# Altium schematic sheet Sensors.SchDoc
size A4; SheetNumber: 4; SheetTotal: 4
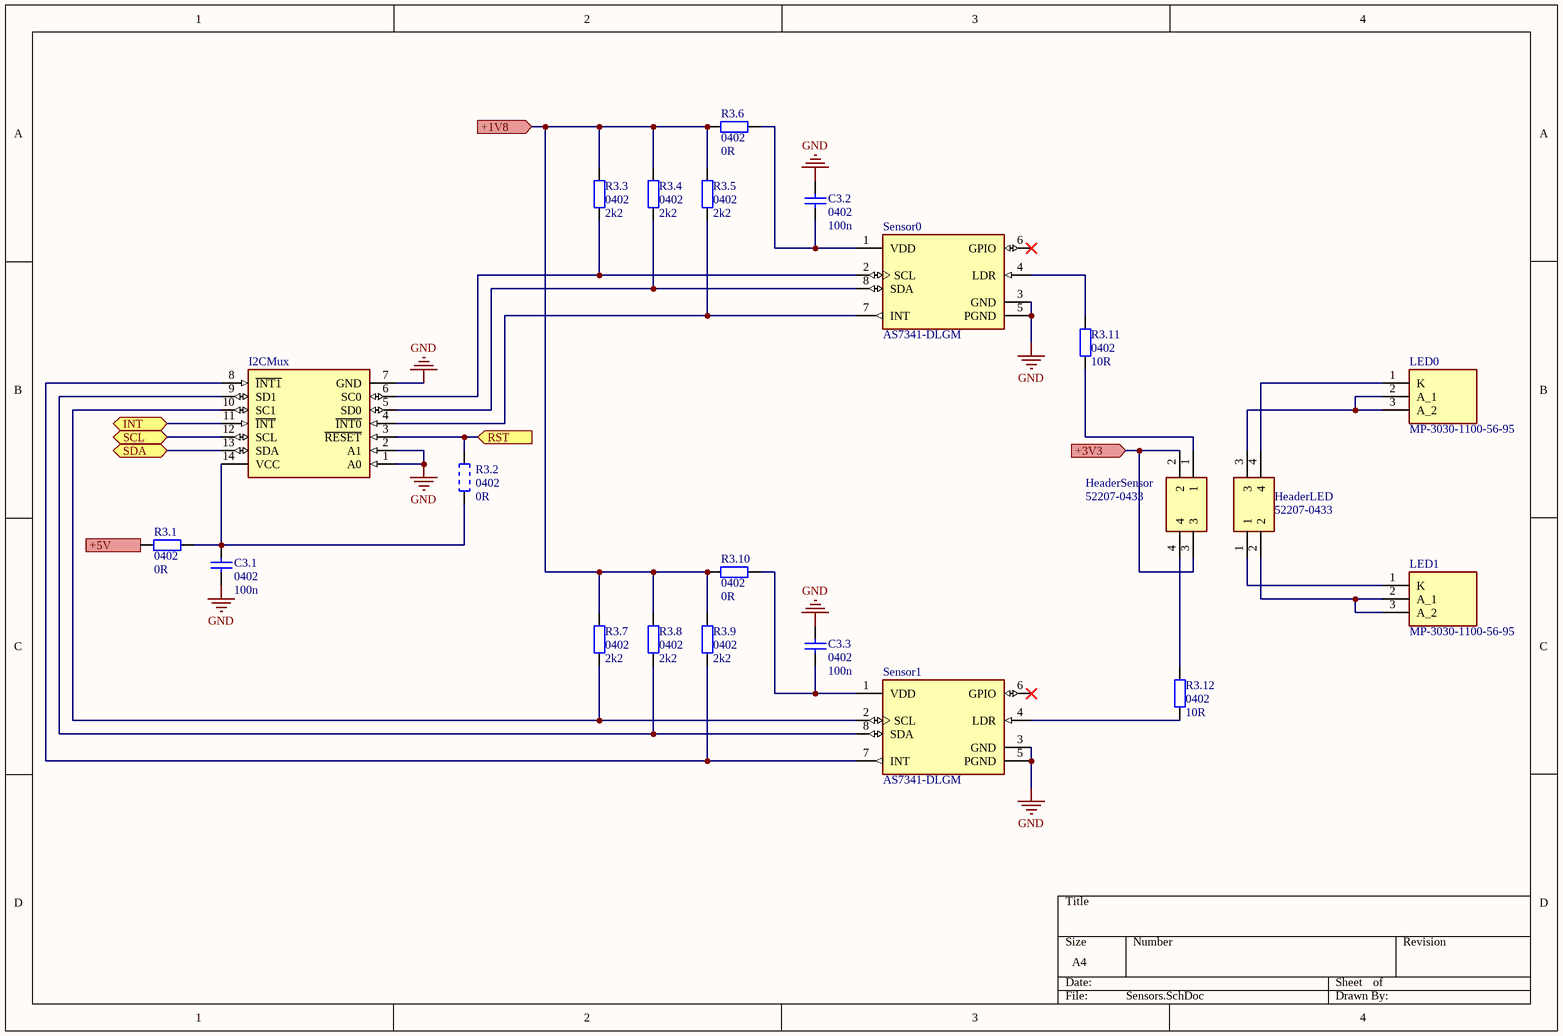
[diagram p0: Sensors.SchDoc]

## Parts
C3.1  0402  value 100n  [C0402_M]
C3.2  0402  value 100n  [C0402_M]
C3.3  0402  value 100n  [C0402_M]
HeaderLED  52207-0433  [52207-0433]
HeaderSensor  52207-0433  [52207-0433]
I2CMux  (no value)  [SOIC127P600X175-14N]
LED0  MP-3030-1100-56-95  [MP303011005780]
LED1  MP-3030-1100-56-95  [MP303011005780]
R3.1  0402  value 0R  [R0402_M]
R3.2  0402  value 0R  [R0402_M_open]  (no BOM)
R3.3  0402  value 2k2  [R0402_M]
R3.4  0402  value 2k2  [R0402_M]
R3.5  0402  value 2k2  [R0402_M]
R3.6  0402  value 0R  [R0402_M]
R3.7  0402  value 2k2  [R0402_M]
R3.8  0402  value 2k2  [R0402_M]
R3.9  0402  value 2k2  [R0402_M]
R3.10  0402  value 0R  [R0402_M]
R3.11  0402  value 10R  [R0402_M]
R3.12  0402  value 10R  [R0402_M]
Sensor0  AS7341-DLGM  [FP-AS7341-DLGM-MFG]
Sensor1  AS7341-DLGM  [FP-AS7341-DLGM-MFG]

## Ports
+1V8 (in), +3V3 (in), +5V (in), INT (bidir), RST (in), SCL (bidir), SDA (bidir)

## Nets
GND: C3.1.1 C3.2.2 C3.3.2 I2CMux.1(A0) I2CMux.2(A1) I2CMux.7(GND) Sensor0.3(GND) Sensor0.5(PGND) Sensor1.3(GND) Sensor1.5(PGND)
+1V8: R3.3.2 R3.4.2 R3.5.2 R3.6.1 R3.7.2 R3.8.2 R3.9.2 R3.10.1 ; port +1V8
+3V3: HeaderSensor.2 HeaderSensor.3 ; port +3V3
+5V: R3.1.1 ; port +5V
INT: I2CMux.11(~{INT}) ; port INT
RST: I2CMux.3(~{RESET}) R3.2.2 ; port RST
SCL: I2CMux.12(SCL) ; port SCL
SDA: I2CMux.13(SDA) ; port SDA
NetC3.1_2: C3.1.2 I2CMux.14(VCC) R3.1.2 R3.2.1
NetC3.2_1: C3.2.1 R3.6.2 Sensor0.1(VDD)
NetC3.3_1: C3.3.1 R3.10.2 Sensor1.1(VDD)
NetHeaderLED_1: HeaderLED.1 LED1.1(K)
NetHeaderLED_2: HeaderLED.2 LED1.2(A_1) LED1.3(A_2)
NetHeaderLED_3: HeaderLED.3 LED0.2(A_1) LED0.3(A_2)
NetHeaderLED_4: HeaderLED.4 LED0.1(K)
NetHeaderSensor_1: HeaderSensor.1 R3.11.1
NetHeaderSensor_4: HeaderSensor.4 R3.12.2
NetI2CMux_4: I2CMux.4(~{INT0}) R3.5.1 Sensor0.7(INT)
NetI2CMux_5: I2CMux.5(SD0) R3.4.1 Sensor0.8(SDA)
NetI2CMux_6: I2CMux.6(SC0) R3.3.1 Sensor0.2(SCL)
NetI2CMux_8: I2CMux.8(~{INT1}) R3.9.1 Sensor1.7(INT)
NetI2CMux_9: I2CMux.9(SD1) R3.8.1 Sensor1.8(SDA)
NetI2CMux_10: I2CMux.10(SC1) R3.7.1 Sensor1.2(SCL)
NetR3.11_2: R3.11.2 Sensor0.4(LDR)
NetR3.12_1: R3.12.1 Sensor1.4(LDR)

Not connected (* = marked no-connect by the designer): Sensor0 6(GPIO)*; Sensor1 6(GPIO)*

## Library data of the parts
C3.1-C3.3 = C0402_X5R_100n_10%: Capacitor; Manufactor: Yageo; ManufactorPartNumber: CC0402KRX5R7BB104; Tech: MLCC X5R; VoltageRating: 16V; TempRating: -55°C to +85°C; Tolerance: 10%; Part Number: C0402_X5R_100n_10%; Type: Capacitor; Supplier 1: Farnell; Supplier Part Number 1: 1816750; Supplier 2: Digi-Key; Supplier Part Number 2: 311-1347-1-ND
HeaderLED HeaderSensor = 52207-0433: Connector; Manufacturer_Name: Molex; Datasheet Link: http://www.molex.com/pdm_docs/sd/522072033_sd.pdf; Manufacturer_Part_Number: 52207-0433; Mouser Part Number: 538-52207-0433; Mouser Price/Stock: https://www.mouser.co.uk/ProductDetail/Molex/52207-0433?qs=rw2VfpiI%2FsN5C%252BrnOc9sng%3D%3D
I2CMux = TCA9543ADR: Integrated Circuit; Manufacturer_Name: Texas Instruments; Datasheet Link: http://www.ti.com/lit/gpn/tca9543a; Height: 1.75mm; Manufacturer_Part_Number: TCA9543ADR; Mouser Part Number: 595-TCA9543ADR; Mouser Price/Stock: https://www.mouser.co.uk/ProductDetail/Texas-Instruments/TCA9543ADR/?qs=WuTGPxIYnC6YhvyolILbYg%3D%3D; Arrow Part Number: TCA9543ADR; Arrow Price/Stock: https://www.arrow.com/en/products/tca9543adr/texas-instruments
LED0 LED1 = MP-3030-1100-57-80: LED; Manufacturer_Name: Luminus Devices Inc.; Datasheet Link: https://www.mouser.jp/datasheet/2/245/Luminus_MP3030_1100_Datasheet-1512110.pdf; Height: 0.52mm; Manufacturer_Part_Number: MP-3030-1100-56-95
R3.1 = R0402_1%_0R: Resistor; Manufactor: Multicomp; ManufactorPartNumber: MC00625W040210R; Tech: Dickschicht; VoltageRating: 50V; PowerRating: 0,0625W; Tolerance: 1%; Part Number: R0402_1%_0R; Type: Resistor; Supplier 1: Farnell; Supplier Part Number 1: 1357983
R3.2 = Res0402open: Resistor; Part Number: Res0402open; Type: Resistor
R3.3-R3.5 R3.7-R3.9 = R0402_1%_1k: Resistor; Manufactor: Vishay; ManufactorPartNumber: CRCW04021K00FKED; Tech: Dickschicht; VoltageRating: 50V; PowerRating: 0,063W; Tolerance: 1%; Part Number: R0402_1%_1k; Type: Resistor
R3.6 R3.10 = R0402_0R: Resistor; Manufactor: Yageo; ManufactorPartNumber: RC0402JR-070RL; Tech: Dickschicht; VoltageRating: 50V; PowerRating: 0,0625W; Tolerance: 1%; Part Number: R0402_0R; Type: Resistor; Supplier 1: Digi-Key; Supplier Part Number 1: 311-0.0JRCT-ND
R3.11 R3.12 = R0402_1%_100R: Resistor; Manufactor: Vishay; ManufactorPartNumber: CRCW0402100RFKEDHP; Tech: Dickschicht; VoltageRating: 50V; PowerRating: 0,125W; Tolerance: 1%; Part Number: R0402_1%_100R; Type: Resistor
Sensor0 Sensor1 = CMP-22831-000004-1: SENSOR AMBIENT LIGHT